# Altium schematic sheet sch_AGV_Communication.SchDoc
size B; SheetNumber: 5; SheetTotal: 6
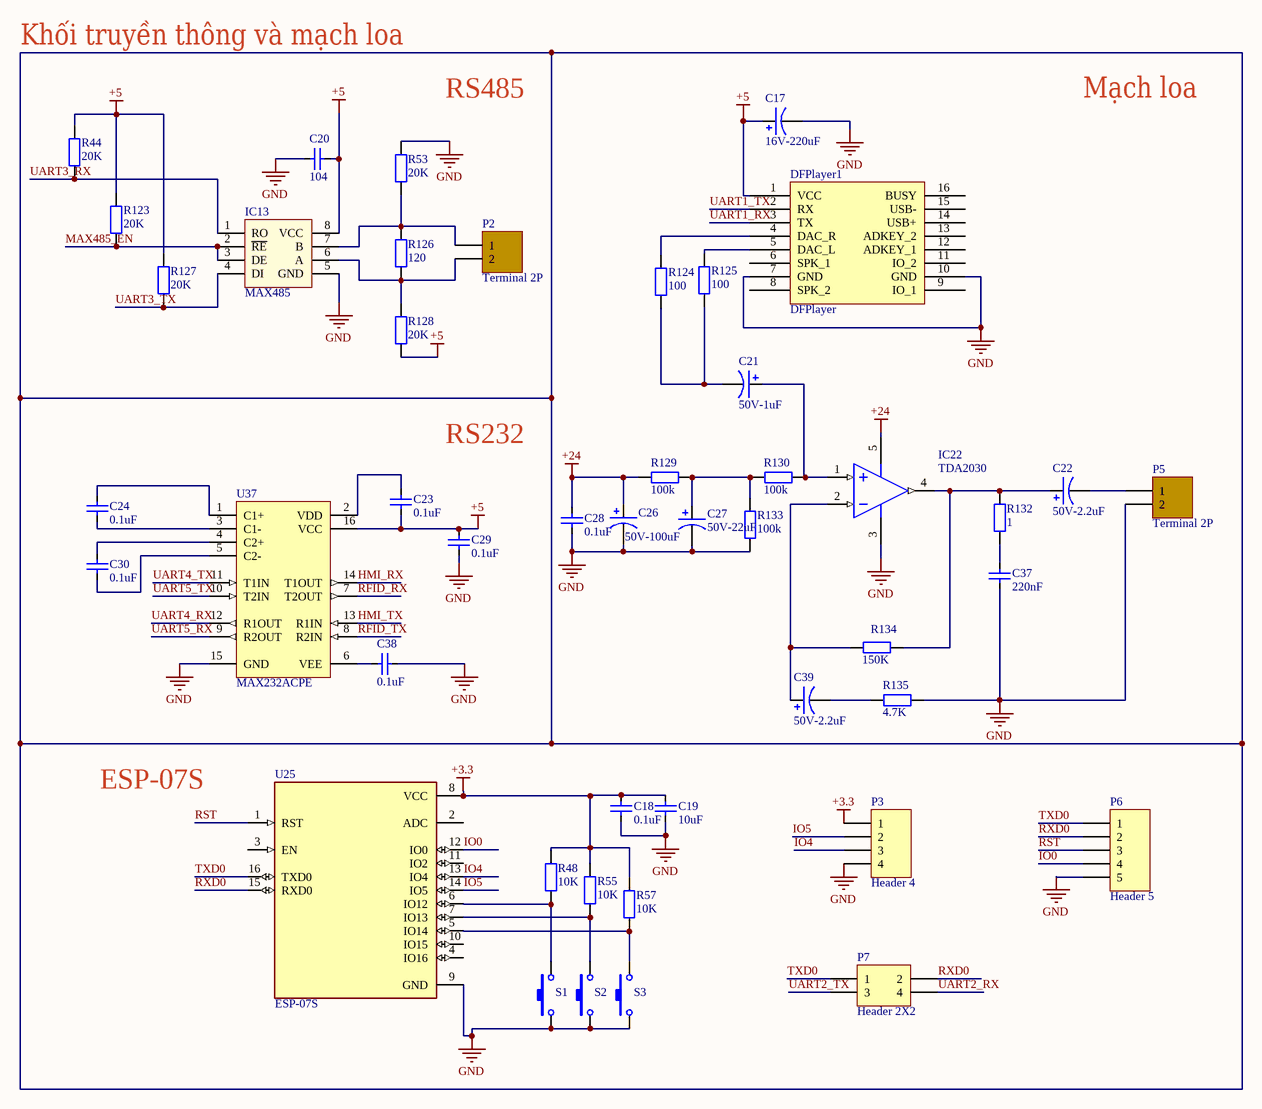
[diagram p0: sch_AGV_Communication.SchDoc]

## Parts
C17  16V-220uF  [CAP_D6.3]
C18  0.1uF  [CAP_0805]
C19  10uF  [CAP_0805]
C20  104  [CAP_0805]
C21  50V-1uF  [CAP_D5]
C22  50V-2.2uF  [CAP_D5]
C23  0.1uF  [CAP_0805]
C24  0.1uF  [CAP_0805]
C26  50V-100uF  [CAP_D8]
C27  50V-22uF  [CAP_D5]
C28  0.1uF  [CAP_0805]
C29  0.1uF  [CAP_0805]
C30  0.1uF  [CAP_0805]
C37  220nF  [CAP_0805]
C38  0.1uF  [CAP_0805]
C39  50V-2.2uF  [CAP_D5]
DFPlayer1  DFPlayer  [DFPlayer]
IC13  MAX485  [SOP8-PP]
IC22  TDA2030  [DIP5SL1]
P2  Terminal 2P  [BIG_Header 2]
P3  Header 4  [HDR4]
P5  Terminal 2P  [BIG_Header 2]
P6  Header 5  [HDR5]
P7  Header 2X2  [JP2X2]
R44  20K  [RES_SMD_0805]
R48  10K  [RES_SMD_0805]
R53  20K  [RES_SMD_0805]
R55  10K  [RES_SMD_0805]
R57  10K  [RES_SMD_0805]
R123  20K  [RES_SMD_0805]
R124  100  [RES_1/4 W]
R125  100  [RES_1/4 W]
R126  120  [RES_SMD_0805]
R127  20K  [RES_SMD_0805]
R128  20K  [RES_SMD_0805]
R129  100k  [RES_1/4 W]
R130  100k  [RES_1/4 W]
R132  1  [RES_1/4 W]
R133  100k  [RES_1/4 W]
R134  150K  [RES_1/4 W]
R135  4.7K  [RES_1/4 W]
S1  SW-SMD  [BUTTON 4 PIN]  (value not drawn)
S2  SW-SMD  [BUTTON 4 PIN]  (value not drawn)
S3  SW-SMD  [BUTTON 4 PIN]  (value not drawn)
U25  ESP-07S  [XCVR_ESP-07S]
U37  MAX232ACPE  [DIP.100/16/W.300/L.900]

## Nets
+3.3: C18.2 C19.2 P3.1 R48.1 R55.1 R57.1 U25.8(VCC)
+5: C17.1 C20.2 C23.1 C29.2 DFPlayer1.1(VCC) IC13.8(VCC) R44.1 R123.2 R127.1 R128.2 U37.16(VCC)
+24: C26.1 C28.2 IC22.5(V+) R129.2
GND: C17.2 C18.1 C19.1 C20.1 C26.2 C27.2 C28.1 C29.1 C37.1 C38.1 DFPlayer1.7(GND) DFPlayer1.10(GND) IC13.5(GND) IC22.3(V-) P3.4 P5.2 P6.5 R53.1 R133.2 R135.1 S1.1 S2.1 S3.1 U25.9(GND) U37.15(GND)
HMI_RX: U37.14(T1OUT)
HMI_TX: U37.13(R1IN)
IO0: P6.4 U25.12(IO0)
IO4: P3.3 U25.13(IO4)
IO5: P3.2 U25.14(IO5)
MAX485_EN: IC13.2(~{RE}) IC13.3(DE) R123.1
RFID_RX: U37.7(T2OUT)
RFID_TX: U37.8(R2IN)
RST: P6.3 U25.1(RST)
RXD0: P6.2 P7.2 U25.15(RXD0)
TXD0: P6.1 P7.1 U25.16(TXD0)
UART1_RX: DFPlayer1.3(TX)
UART1_TX: DFPlayer1.2(RX)
UART2_RX: P7.4
UART2_TX: P7.3
UART3_RX: IC13.1(RO) R44.2
UART3_TX: IC13.4(DI) R127.2
UART4_RX: U37.12(R1OUT)
UART4_TX: U37.11(T1IN)
UART5_RX: U37.9(R2OUT)
UART5_TX: U37.10(T2IN)
NetC21_1: C21.1 IC22.1(IN+) R130.1
NetC21_2: C21.2 R124.2 R125.2
NetC22_1: C22.1 IC22.4(OUT) R132.1 R134.1
NetC22_2: C22.2 P5.1
NetC23_2: C23.2 U37.2(VDD)
NetC24_1: C24.1 U37.3(C1-)
NetC24_2: C24.2 U37.1(C1+)
NetC27_1: C27.1 R129.1 R130.2 R133.1
NetC30_1: C30.1 U37.5(C2-)
NetC30_2: C30.2 U37.4(C2+)
NetC37_2: C37.2 R132.2
NetC38_2: C38.2 U37.6(VEE)
NetC39_1: C39.1 IC22.2(IN-) R134.2
NetC39_2: C39.2 R135.2
NetDFPlayer1_4: DFPlayer1.4(DAC_R) R124.1
NetDFPlayer1_5: DFPlayer1.5(DAC_L) R125.1
NetIC13_6: IC13.6(A) P2.2 R126.2 R128.1
NetIC13_7: IC13.7(B) P2.1 R53.2 R126.1
NetR48_2: R48.2 S1.2 U25.6(IO12)
NetR55_2: R55.2 S2.2 U25.7(IO13)
NetR57_2: R57.2 S3.2 U25.5(IO14)

Not connected (* = marked no-connect by the designer): DFPlayer1 6(SPK_1) 8(SPK_2) 9(IO_1) 11(IO_2) 12(ADKEY_1) 13(ADKEY_2) 14(USB+) 15(USB-) 16(BUSY); U25 2(ADC) 3(EN) 4(IO16) 10(IO15) 11(IO2)

## Notes on the sheet
- Khối truyền thông và mạch loa
- RS485
- Mạch loa
- RS232
- ESP-07S

## Library data of the parts
C17 C21 C22 C26 C27 C39 = CapPol: Polarized Capacitor (Axial); Published: 8-Jun-2000; LatestRevisionDate: 17-Jul-2002; LatestRevisionNote: Re-released for DXP Platform.; PackageReference: POLAR0.8; Publisher: Altium Limited
C18-C20 C23 C24 C28-C30 C37 C38 = CapSMD: Capacitor; Value: 33p; Published: 8-Jun-2000; LatestRevisionDate: 17-Jul-2002; LatestRevisionNote: Re-released for DXP Platform.; PackageReference: RAD-0.3; Publisher: Altium Limited
IC13 = MAX485: RS232 - RS485 (Same sn75176)
IC22 = TDA2030: 14W Hi-Fi AUDIO AMPLIFIER; Value: TDA2030
P2 P5 = Terminal 2P: Terminal 5.08; LatestRevisionDate: 17-Jul-2002; LatestRevisionNote: Re-released for DXP Platform.; Publisher: Altium Limited
P3 = Header 4: Header, 4-Pin; LatestRevisionDate: 17-Jul-2002; LatestRevisionNote: Re-released for DXP Platform.; Publisher: Altium Limited
P6 = Header 5: Header, 5-Pin; LatestRevisionDate: 17-Jul-2002; LatestRevisionNote: Re-released for DXP Platform.; Publisher: Altium Limited
P7 = Header 2X2: Header, 2-Pin, Dual row; LatestRevisionDate: 17-Jul-2002; LatestRevisionNote: Re-released for DXP Platform.; Publisher: Altium Limited
R44 R48 R53 R55 R57 R123-R130 R132-R135 = Res: Resistor; Manufacturer: Generic Components; Class: Passive; Published: 08/06/2000; Publisher: Altium Hobart Technology Centre
S1-S3 = SW-SMD: Switch; Published: 24-Mar-1999; LatestRevisionDate: 17-Jul-2002; LatestRevisionNote: Re-released for DXP Platform.; PackageReference: SPST-2; Publisher: Altium Limited
U25 = ESP-07S: WiFi 802.11b/g/n Transceiver Module 2.4GHz ~ 2.5GHz PCB Trace Surface Mount; MF: RF Solutions; SnapEDA_Link: https://www.snapeda.com/parts/ESP-07S/RF+Solutions/view-part/?ref=snap; Package: NON-STANDARD-16 RF SOLUTIONS; Value: *; MP: ESP-07S; Check_prices: https://www.snapeda.com/parts/ESP-07S/RF+Solutions/view-part/?ref=eda
U37 = MAX232ACPE: +5V Powered, Multi-Channel RS-232 Driver/Receiver; Published: 16-Jan-2001; LatestRevisionDate: 06-Jun-2005; LatestRevisionNote: Stylized 3D Model Added.; PackageVersion: 1997; PackageReference: PE16A; Publisher: Altium Limited; PackageDescription: DIP; 16 Leads; Row Spacing 7.62 mm; Pitch 2.54 mm; Code_JEDEC: MS-001-BB; ComponentLink1Description: Manufacturer Link; ComponentLink1URL: http://www.maxim-ic.com/; ComponentLink2Description: Datasheet; ComponentLink2URL: http://pdfserv.maxim-ic.com/en/ds/MAX220-MAX249.pdf